# Altium schematic sheet OV7670s.SchDoc
size A
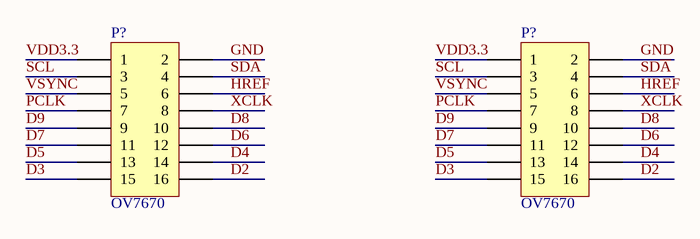
[diagram p0: OV7670s.SchDoc]

## Parts
(Parts that share a designator on the sheet are numbered #1, #2 ... from top to bottom, then left to right.)
P?#1  OV7670  [HDR2X8]
P?#2  OV7670  [HDR2X8]

## Nets
D2: P?#1.16 P?#2.16
D3: P?#1.15 P?#2.15
D4: P?#1.14 P?#2.14
D5: P?#1.13 P?#2.13
D6: P?#1.12 P?#2.12
D7: P?#1.11 P?#2.11
D8: P?#1.10 P?#2.10
D9: P?#1.9 P?#2.9
GND: P?#1.2 P?#2.2
HREF: P?#1.6 P?#2.6
PCLK: P?#1.7 P?#2.7
SCL: P?#1.3 P?#2.3
SD~{A}: P?#1.4 P?#2.4
VDD3.3: P?#1.1 P?#2.1
VSYNC: P?#1.5 P?#2.5
XCLK: P?#1.8 P?#2.8

## Library data of the parts
P?#1 P?#2 = Header 8X2: Header, 8-Pin, Dual row; LatestRevisionDate: 17-Jul-2002; LatestRevisionNote: Re-released for DXP Platform.; Publisher: Altium Limited